# Altium project My_PCB_Board_STM32F407IGT6.PrjPcb
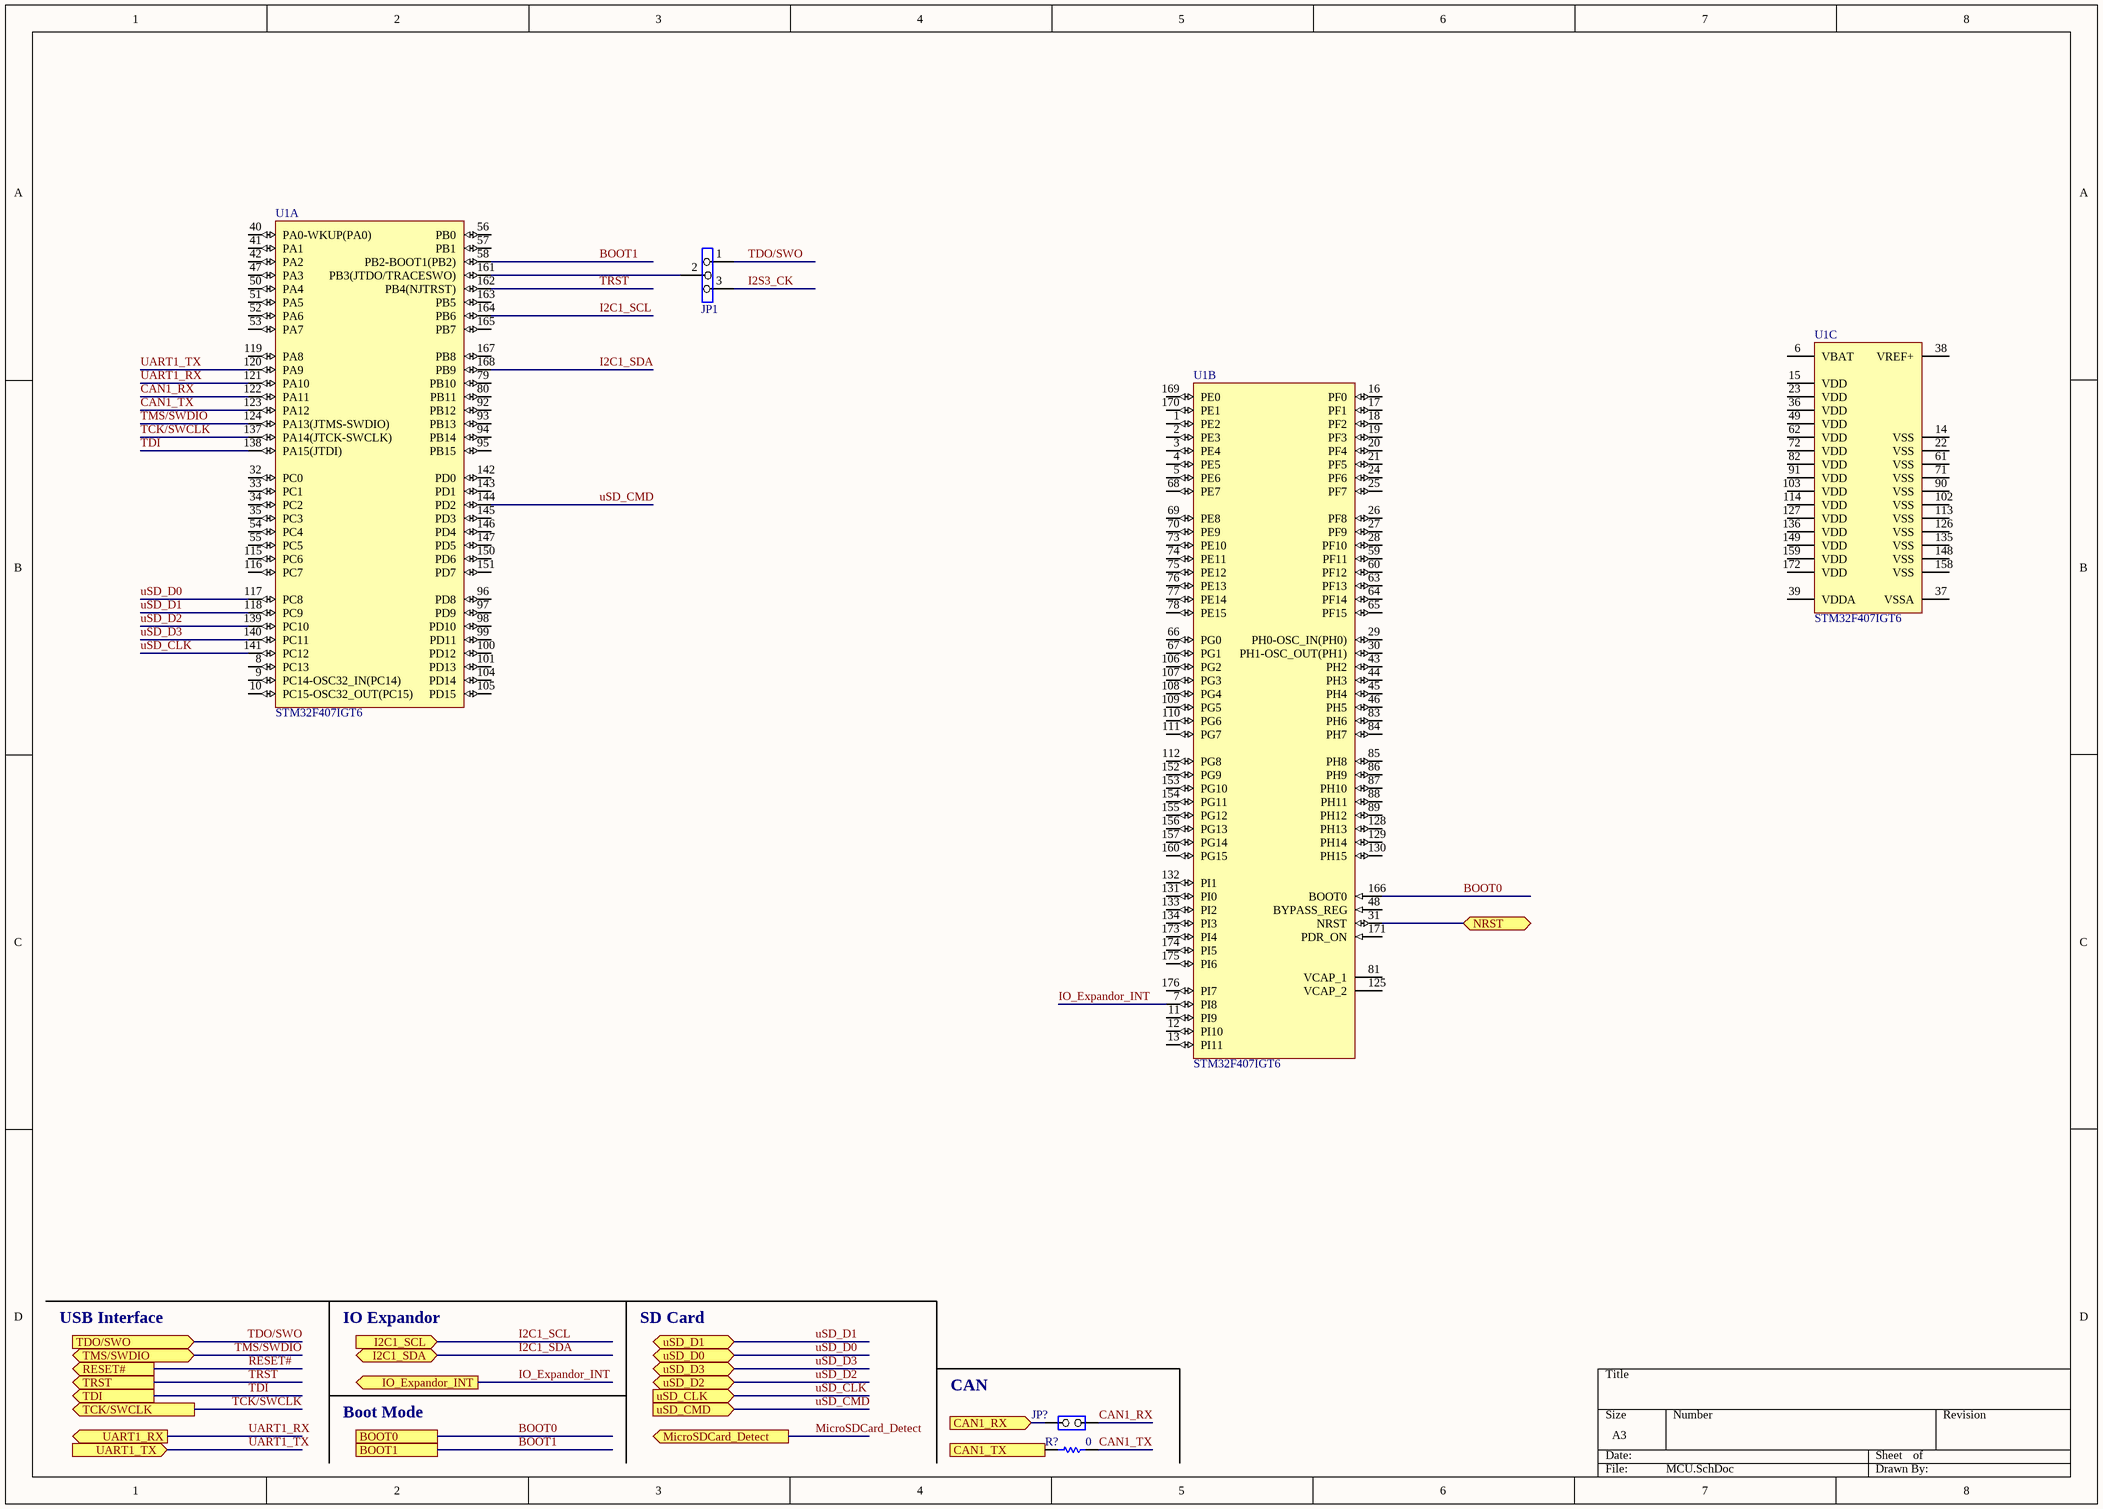
[diagram p0: MCU.SchDoc]
4 sheets, 82 parts. Net scope: flat (ports and power ports of the same name join across sheets).
Board file: PCB1.PcbDoc
Sheets:
  MCU.SchDoc
  Peripherals.SchDoc
  Display-Interface.SchDoc
  Program_Debug-Interface.SchDoc

## Sheet MCU.SchDoc
size A3

### Parts
(Parts that share a designator on the sheet are numbered #1, #2 ... from top to bottom, then left to right.)
JP1  (no value)  [SIP3]
JP?  (no value)  [SIP2]
R?#1  0  [0603R]
U1  STM32F407IGT6  [STM-LQFP176_M]  (parts A,B,C of 3)

### Ports
BOOT0, BOOT1, CAN1_RX (in), CAN1_TX (out), I2C1_SCL (in), I2C1_SDA (bidir), IO_Expandor_INT (out), MicroSDCard_Detect (out), NRST (bidir), RESET# (out), TCK/SWCLK (out), TDI (out), TDO/SWO (in), TMS/SWDIO (bidir), TRST (out), UART1_RX (out), UART1_TX (in), uSD_CLK (in), uSD_CMD (in), uSD_D0 (bidir), uSD_D1 (bidir), uSD_D2 (bidir), uSD_D3 (bidir)

### Nets
BOOT0: U1.166(BOOT0) ; port BOOT0
BOOT1: U1.58(PB2-BOOT1(PB2)) ; port BOOT1
CAN1_RX: JP?.1(COMMON) U1.122(PA11)
CAN1_TX: R?#1.1 U1.123(PA12)
I2C1_SCL: U1.164(PB6) ; port I2C1_SCL
I2C1_SDA: U1.168(PB9) ; port I2C1_SDA
I2S3_CK: JP1.3
IO_Expandor_INT: U1.7(PI8) ; port IO_Expandor_INT
RESET#: U1.31(NRST) ; port NRST
TCK/SWCLK: U1.137(PA14(JTCK-SWCLK)) ; port TCK/SWCLK  [project net T_JTCK]
TDI: U1.138(PA15(JTDI)) ; port TDI  [project net T_JTDI]
TDO/SWO: JP1.1 ; port TDO/SWO  [project net T_JTDO]
TMS/SWDIO: U1.124(PA13(JTMS-SWDIO)) ; port TMS/SWDIO  [project net T_JTMS]
TRST: U1.162(PB4(NJTRST)) ; port TRST  [project net T_JRST]
UART1_RX: U1.121(PA10) ; port UART1_RX
UART1_TX: U1.120(PA9) ; port UART1_TX
uSD_CLK: U1.141(PC12) ; port uSD_CLK
uSD_CMD: U1.144(PD2) ; port uSD_CMD
uSD_D0: U1.117(PC8) ; port uSD_D0
uSD_D1: U1.118(PC9) ; port uSD_D1
uSD_D2: U1.139(PC10) ; port uSD_D2
uSD_D3: U1.140(PC11) ; port uSD_D3
NetJP1_2: JP1.2 U1.161(PB3(JTDO/TRACESWO))
NetJP?_2: JP?.2(NO) ; port CAN1_RX
NetR?#1_2: R?#1.2 ; port CAN1_TX

Not connected (* = marked no-connect by the designer): U1 1(PE2) 2(PE3) 3(PE4) 4(PE5) 5(PE6) 6(VBAT) 8(PC13) 9(PC14-OSC32_IN(PC14)) 10(PC15-OSC32_OUT(PC15)) 11(PI9) 12(PI10) 13(PI11) 14(VSS) 15(VDD) 16(PF0) 17(PF1) 18(PF2) 19(PF3) 20(PF4) 21(PF5) 22(VSS) 23(VDD) 24(PF6) 25(PF7) 26(PF8) 27(PF9) 28(PF10) 29(PH0-OSC_IN(PH0)) 30(PH1-OSC_OUT(PH1)) 32(PC0) 33(PC1) 34(PC2) 35(PC3) 36(VDD) 37(VSSA) 38(VREF+) 39(VDDA) 40(PA0-WKUP(PA0)) 41(PA1) 42(PA2) 43(PH2) 44(PH3) 45(PH4) 46(PH5) 47(PA3) 48(BYPASS_REG) 49(VDD) 50(PA4) 51(PA5) 52(PA6) 53(PA7) 54(PC4) 55(PC5) 56(PB0) 57(PB1) 59(PF11) 60(PF12) 61(VSS) 62(VDD) 63(PF13) 64(PF14) 65(PF15) 66(PG0) 67(PG1) 68(PE7) 69(PE8) 70(PE9) 71(VSS) 72(VDD) 73(PE10) 74(PE11) 75(PE12) 76(PE13) 77(PE14) 78(PE15) 79(PB10) 80(PB11) 81(VCAP_1) 82(VDD) 83(PH6) 84(PH7) 85(PH8) 86(PH9) 87(PH10) 88(PH11) 89(PH12) 90(VSS) 91(VDD) 92(PB12) 93(PB13) 94(PB14) 95(PB15) 96(PD8) 97(PD9) 98(PD10) 99(PD11) 100(PD12) 101(PD13) 102(VSS) 103(VDD) 104(PD14) 105(PD15) 106(PG2) 107(PG3) 108(PG4) 109(PG5) 110(PG6) 111(PG7) 112(PG8) 113(VSS) 114(VDD) 115(PC6) 116(PC7) 119(PA8) 125(VCAP_2) 126(VSS) 127(VDD) 128(PH13) 129(PH14) 130(PH15) 131(PI0) 132(PI1) 133(PI2) 134(PI3) 135(VSS) 136(VDD) 142(PD0) 143(PD1) 145(PD3) 146(PD4) 147(PD5) 148(VSS) 149(VDD) 150(PD6) 151(PD7) 152(PG9) 153(PG10) 154(PG11) 155(PG12) 156(PG13) 157(PG14) 158(VSS) 159(VDD) 160(PG15) 163(PB5) 165(PB7) 167(PB8) 169(PE0) 170(PE1) 171(PDR_ON) 172(VDD) 173(PI4) 174(PI5) 175(PI6) 176(PI7)

### Notes on the sheet
- USB Interface
- IO Expandor
- SD Card
- CAN
- Boot Mode

### Library data of the parts
JP1 = Jumper3
JP? = JP2
R?#1 = Res1: Resistor; Value: 1K; Published: 8-Jun-2000; Revision: July-2002: Re-released for DXP Platform.; Publisher: Altium Limited
U1 = CMP-0243-00010-3: ARM Cortex-M4 32-bit MCU+FPU, 210 DMIPS, 1024 kB Flash, 192 kB Internal RAM, 140 I/Os, 176-pin LQFP, -40 to 85 degC, Tray; Manufacturer: STMicroelectronics; Internal RAM Size (kB): 192; Operating Frequency(F) (Processor speed) (MHz): 168; D/A Converter: 2x12-bit; FLASH Size (Prog) (kB): 1024; Supply Voltage(Vcc) max (V): 3.6; Supply Voltage(Vcc) min (V): 1.8; I/Os (High Current): 140; Packing: Tray; ComponentLink2Description: Datasheet; ComponentLink1Description: Manufacturer URL; DatasheetVersion: Rev. 4; PackageReference: LQFP176; PackageVersion: Rev. 4, 06/2013; ComponentLink1URL: http://www.st.com/web/en/home.html; ComponentLink3URL: http://www.st.com/st-web-ui/static/active/en/resource/technical/document/datasheet/DM00035129.pdf; ComponentLink2URL: http://www.st.com/st-web-ui/static/active/en/resource/technical/document/datasheet/DM00037051.pdf; Mounting Technology: Surface Mount; PartNumber: STM32F407IGT6; Core: ARM Cortex-M4; PackageDescription: 176-Pin Low Profile Quad Flat Package, 24 x 24 mm Body, 0.5 mm Pitch; ComponentLink3Description: Package Specification

## Sheet Peripherals.SchDoc
size A3
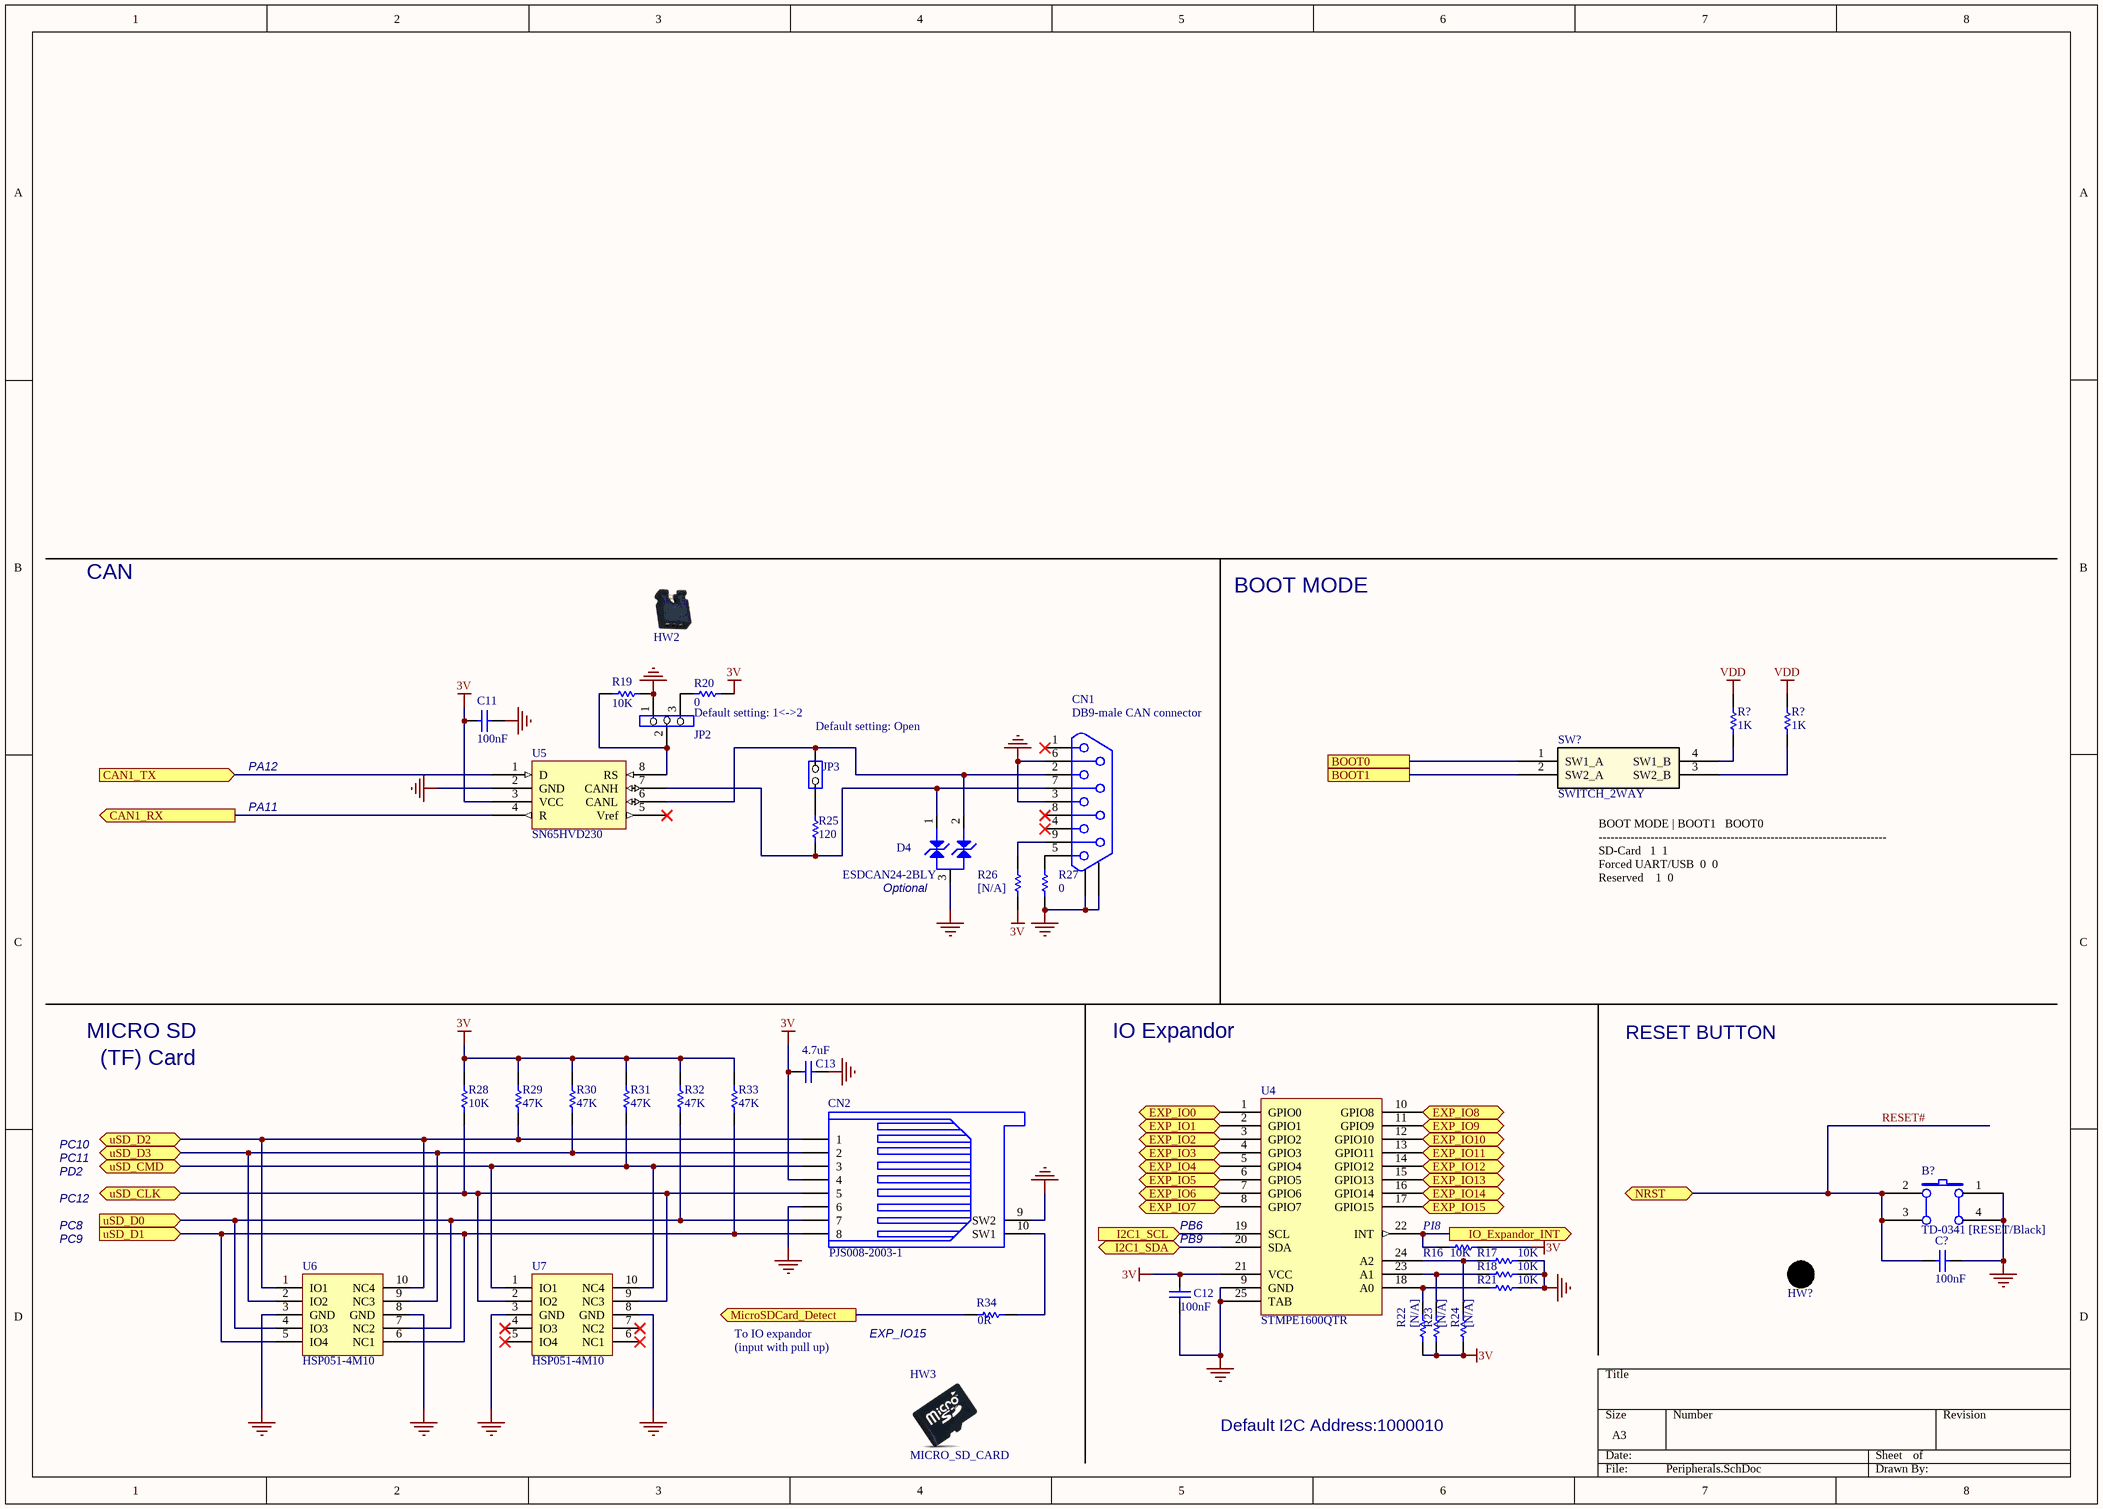
[diagram p1: Peripherals.SchDoc]

### Parts
(Parts that share a designator on the sheet are numbered #1, #2 ... from top to bottom, then left to right.)
B?  TD-0341 [RESET/Black]  [PB10]
C11  100nF  [0603C]
C12  100nF  [0603C]
C13  value 4.7uF  [C0402]  (hidden comment: Capacitor)
C?  100nF  [0603C]
CN1  DB9-male CAN connector  [DB9/M]
CN2  value PJS008-2003-1  [CON_MICROSD_YAMAICHI_PJS008-2003-0]
D4  ESDCAN24-2BLY  [SOT23-213]
HW2  JUMPER_OPEN  (value not drawn)
HW3  Micro_SD_card  (mechanical)
HW?  BUTTON_HAT_BLACK  (value not drawn)  (mechanical)
JP2  (no value)  [SIP3]
JP3  (no value)  [SIP2]
R16  10K  [0603R]
R17  10K  [0603R]
R18  10K  [0603R]
R19  10K  [0603R]
R20  0  [0603R]
R21  10K  [0603R]
R22  [N/A]  [0603R]
R23  [N/A]  [0603R]
R24  [N/A]  [0603R]
R25  120  [0603R]
R26  [N/A]  [0603R]
R27  0  [0603R]
R28  value 10K  [R0402]
R29  value 47K  [R0402]
R30  value 47K  [R0402]
R31  value 47K  [R0402]
R32  value 47K  [R0402]
R33  value 47K  [R0402]
R34  value 0R  [R0402]
R?#2  value 1K  [R0402]
R?#3  value 1K  [R0402]
SW?  SWITCH_2WAY  [SWI_C&K_SDA02H1SBD_2POS]
U4  STMPE1600QTR  [QFN24_0R5_4X4]
U5  SN65HVD230  [SOIC8_1R27_4R9X6]
U6  HSP051-4M10  [ESD_UQFN-10L_2P5X1_P050]
U7  HSP051-4M10  [ESD_UQFN-10L_2P5X1_P050]

### Ports
BOOT0, BOOT1, CAN1_RX (out), CAN1_TX (in), EXP_IO0 (bidir), EXP_IO1 (bidir), EXP_IO2 (bidir), EXP_IO3 (bidir), EXP_IO4 (bidir), EXP_IO5 (bidir), EXP_IO6 (bidir), EXP_IO7 (bidir), EXP_IO8 (bidir), EXP_IO9 (bidir), EXP_IO10 (bidir), EXP_IO11 (bidir), EXP_IO12 (bidir), EXP_IO13 (bidir), EXP_IO14 (bidir), EXP_IO15 (bidir), I2C1_SCL (in), I2C1_SDA (bidir), IO_Expandor_INT (out), MicroSDCard_Detect (out), NRST (bidir), uSD_CLK (bidir), uSD_CMD (bidir), uSD_D0 (in), uSD_D1 (in), uSD_D2 (bidir), uSD_D3 (bidir)

### Nets
3V: C11.1 C12.1 C13.2 CN2.4 R16.1 R20.2 R22.1 R23.1 R24.1 R26.1 R28.2 R29.2 R30.2 R31.2 R32.2 R33.2 U4.21(VCC) U5.3(VCC)
GND: B?.1(A0) B?.4(A1) C11.2 C12.2 C13.1 C?.1 CN1.3 CN1.6 CN1.10 CN1.11 CN2.6 CN2.9(SW2) D4.3 JP2.1 R17.1 R18.1 R19.2 R21.1 R27.1 U4.9(GND) U4.25(TAB) U5.2(GND) U6.3(GND) U6.8(GND) U7.3(GND) U7.8(GND)
VDD: R?#2.2 R?#3.2
BOOT0: SW?.1(SW1_A) ; port BOOT0
BOOT1: SW?.2(SW2_A) ; port BOOT1
I2C1_SCL: U4.19(SCL) ; port I2C1_SCL
I2C1_SDA: U4.20(SDA) ; port I2C1_SDA
IO_Expandor_INT: R16.2 U4.22(INT) ; port IO_Expandor_INT
MicroSDCard_Detect: R34.1 ; port MicroSDCard_Detect
RESET#: B?.2(B0) B?.3(B1) C?.2 ; port NRST
uSD_CLK: CN2.5 R28.1 U7.2(IO2) U7.9(NC3) ; port uSD_CLK
uSD_CMD: CN2.3 R31.1 U7.1(IO1) U7.10(NC4) ; port uSD_CMD
uSD_D0: CN2.7 R32.1 U6.4(IO3) U6.7(NC2) ; port uSD_D0
uSD_D1: CN2.8 R33.1 U6.5(IO4) U6.6(NC1) ; port uSD_D1
uSD_D2: CN2.1 R29.1 U6.1(IO1) U6.10(NC4) ; port uSD_D2
uSD_D3: CN2.2 R30.1 U6.2(IO2) U6.9(NC3) ; port uSD_D3
NetCN1_2: CN1.2 D4.2 JP3.2(NO) U5.6(CANL)
NetCN1_5: CN1.5 R27.2
NetCN1_7: CN1.7 D4.1 R25.1 U5.7(CANH)
NetCN1_9: CN1.9 R26.2
NetCN2_10: CN2.10(SW1) R34.2
NetJP2_2: JP2.2 R19.1 U5.8(RS)
NetJP2_3: JP2.3 R20.1
NetJP3_1: JP3.1(COMMON) R25.2
NetJP?_2: U5.4(R) ; port CAN1_RX
NetR17_2: R17.2 R24.2 U4.24(A2)
NetR18_2: R18.2 R23.2 U4.23(A1)
NetR21_2: R21.2 R22.2 U4.18(A0)
NetR?#1_2: U5.1(D) ; port CAN1_TX
NetR?#2_1: R?#2.1 SW?.4(SW1_B)
NetR?#3_1: R?#3.1 SW?.3(SW2_B)
NetU4_1: U4.1(GPIO0) ; port EXP_IO0
NetU4_2: U4.2(GPIO1) ; port EXP_IO1
NetU4_3: U4.3(GPIO2) ; port EXP_IO2
NetU4_4: U4.4(GPIO3) ; port EXP_IO3
NetU4_5: U4.5(GPIO4) ; port EXP_IO4
NetU4_6: U4.6(GPIO5) ; port EXP_IO5
NetU4_7: U4.7(GPIO6) ; port EXP_IO6
NetU4_8: U4.8(GPIO7) ; port EXP_IO7
NetU4_10: U4.10(GPIO8) ; port EXP_IO8
NetU4_11: U4.11(GPIO9) ; port EXP_IO9
NetU4_12: U4.12(GPIO10) ; port EXP_IO10
NetU4_13: U4.13(GPIO11) ; port EXP_IO11
NetU4_14: U4.14(GPIO12) ; port EXP_IO12
NetU4_15: U4.15(GPIO13) ; port EXP_IO13
NetU4_16: U4.16(GPIO14) ; port EXP_IO14
NetU4_17: U4.17(GPIO15) ; port EXP_IO15

Not connected (* = marked no-connect by the designer): CN1 1* 4* 8*; U5 5(Vref)*; U7 4(IO3)* 5(IO4)* 6(NC1)* 7(NC2)*

### Notes on the sheet
- CAN
- BOOT MODE
- Default setting: 1<->2
- PA12
- (near JP3) Default setting: Open
- PA11
- (near D4) Optional
- (near SW?) BOOT MODE	|	BOOT1 		BOOT0
  ------------------------------------------------------------------------
  SD-Card			1		1
  Forced UART/USB		0		0
  Reserved 			1		0
- MICRO SD
- IO Expandor
- RESET BUTTON
- (TF) Card
- PC10
- PC11
- PD2
- PC8
- PC9
- PC12
- PB9
- PB6
- (near R16) PI8
- (input with pull up)
- To IO expandor
- EXP_IO15
- Default I2C Address:1000010

### Library data of the parts
B? = SW PUSHBUTTON: SE PUSHBUTTON
C11 C12 = Cap: Capacitor; Value: 10nF; Published: 8-Jun-2000; Revision: July-2002: Re-released for DXP Platform.; Publisher: Altium Limited
C13 = MCD-01356: Capacitor, MLCC, 4.7uF, 6V3, X5R, 20%, 0402, T=0,5mm; Manufacturer_Part_Number: GRM155R60J475ME47; Manufacturer: MURATA; Provided_By: SUBCO; Internal_Part_Number: MCD-01356; Status: Released; Part_Type: Capacitor; Package: C0402; ComponentLink1Description: Datasheet; ComponentLink1URL: http://tunmcdsvn.tun.st.com/Component_Datasheet_Library/Trunk/Capacitors/Murata_Capacitor_GR_series
C? = CAP: Capacitor; Value: 100pF; Published: 8-Jun-2000; Revision: July-2002: Re-released for DXP Platform.; Publisher: Altium Limited
CN1 = DB9-CAN
CN2 = MCD-00023: MicroSD Card Conn, Reversed-Type, Mnt Push-Push; Manufacturer: YAMAICHI; Part_Type: Connector; Provided_By: SUBCO; Initial_Board_Reference: mb1274; Internal_Part_Number: MCD-00023; Manufacturer_Part_Number: PJS008-2003-1; ComponentLink1Description: Datasheet; ECCN_US: n/a; ECCN_EU: n/a; Status: Released; ComponentLink1URL: http://tunmcdsvn.tun.st.com/Component_Datasheet_Library/Trunk/Connectors/Yamaichi_Connector_microSD-Card-PJS008-2003
HW3 = MCD-01200: MICRO_SD_CARD Standard min 4GB; Part_Type: Misc; Manufacturer: NETAC; Alternate_Manufacturer: Jiubaba; Alternate_Manufacturer_Part_Number: 988.05.20.3.00018; Provided_By: SUBCO; Initial_Board_Reference: MB1372; Internal_Part_Number: MCD-01200; Value: MICRO_SD_CARD; Status: Checked; Manufacturer_Part_Number: SD_CARD; ComponentLink1Description: Datasheet; ComponentLink1URL: http://na; ECCN_US: n/a; ECCN_EU: n/a
JP2 = Jumper3
JP3 = JP2
R16 R19 R22-R24 = Res1: Resistor; Value: 1K; Published: 8-Jun-2000; Revision: July-2002: Re-released for DXP Platform.; Publisher: Altium Limited
R17 R18 R20 R21 R25-R27 = res1: Resistor; Value: 1K; Published: 8-Jun-2000; Revision: July-2002: Re-released for DXP Platform.; Publisher: Altium Limited
R28 = MCD-00053: Resistor,10K,0402,1%,1/16W; Manufacturer_Part_Number: RC0402FR-0710KL; Manufacturer: YAGEO; Provided_By: SUBCO; Initial_Board_Reference: mb1274; Internal_Part_Number: MCD-00053; ComponentLink1Description: Datasheet; ECCN_US: n/a; ECCN_EU: n/a; Status: Released; Part_Type: Resistor; ComponentLink1URL: http://tunmcdsvn.tun.st.com/Component_Datasheet_Library/Trunk/Resistors/Yageo_Resistor_RC0402-series; Package: R0402
R29-R33 = MCD-00063: Resistor,47K,0402,1%,1/16W; Manufacturer_Part_Number: RC0402FR-0747KL; Manufacturer: YAGEO; Provided_By: SUBCO; Initial_Board_Reference: mb1274; Internal_Part_Number: MCD-00063; ComponentLink1Description: Datasheet; ECCN_US: n/a; ECCN_EU: n/a; Status: Released; Part_Type: Resistor; ComponentLink1URL: http://tunmcdsvn.tun.st.com/Component_Datasheet_Library/Trunk/Resistors/Yageo_Resistor_RC0402-series; Package: R0402
R34 = MCD-00052: Resistor,0R,0402,5%,1/16W; Manufacturer_Part_Number: RC0402JR-070RL; Manufacturer: YAGEO; Provided_By: SUBCO; Initial_Board_Reference: mb1274; Internal_Part_Number: MCD-00052; ComponentLink1Description: Datasheet; ECCN_US: n/a; ECCN_EU: n/a; Status: Released; Part_Type: Resistor; ComponentLink1URL: http://tunmcdsvn.tun.st.com/Component_Datasheet_Library/Trunk/Resistors/Yageo_Resistor_RC0402-series; Package: R0402
R?#2 R?#3 = MCD-00061: Resistor,1K,0402,1%,1/16W; Manufacturer_Part_Number: RC0402FR-071KL; Manufacturer: YAGEO; Provided_By: SUBCO; Initial_Board_Reference: mb1274; Internal_Part_Number: MCD-00061; ComponentLink1Description: Datasheet; ECCN_US: n/a; ECCN_EU: n/a; Status: Released; Part_Type: Resistor; ComponentLink1URL: http://tunmcdsvn.tun.st.com/Component_Datasheet_Library/Trunk/Resistors/Yageo_Resistor_RC0402-series; Package: R0402
SW? = MCD-00658: Dip Switch ,2Position ,Surface Mount Slide (Standard) ,2.54 pitch,25mA 24VDC; Part_Type: Misc; Manufacturer_Part_Number: SDA02H1SBD; Manufacturer: C&K; Provided_By: SUBCO; Initial_Board_Reference: MB1272; Internal_Part_Number: MCD-00658; Value: SWITCH_2WAY; Status: Footprint available; Package: DIP; ComponentLink1Description: Datasheet; ComponentLink1URL: http://tunmcdsvn.tun.st.com/Component_Datasheet_Library/Trunk/Misc/CK_switch_dip_sda_series; ECCN_US: n/a; ECCN_EU: n/a
U4 = STMPE1600
U5 = SN65HVD230D
U6 U7 = MCD-00667: 4-line ESD protection for high speed lines; Part_Type: Diode; Manufacturer: STMICROELECTRONICS; BMS_Part_Number: 9179041; ECCN_US: EAR99; ECCN_EU: NEC; Provided_By: SUBCO with ST control; Initial_Board_Reference: MB1331; Internal_Part_Number: MCD-00667; Value: HSP051-4M10; Status: Checked; Manufacturer_Part_Number: HSP051-4M10; Package: uQFN-10L; ComponentLink1Description: Datasheet; ComponentLink1URL: http://tunmcdsvn.tun.st.com/Component_Datasheet_Library/Trunk/Diodes/STM_ESD_HSP051-4M10

## Sheet Display-Interface.SchDoc
size A3
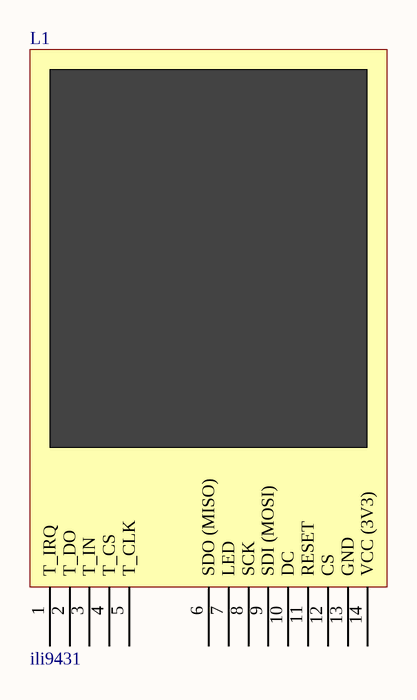
[diagram p2: Display-Interface.SchDoc]

### Parts
L1  ili9431  [ILI9431]

### Nets

Not connected (* = marked no-connect by the designer): L1 1(T_IRQ) 2(T_DO) 3(T_IN) 4(T_CS) 5(T_CLK) 6(SDO_(MISO)) 7(LED) 8(SCK) 9(SDI_(MOSI)) 10(DC) 11(RESET) 12(CS) 13(GND) 14(VCC_(3V3))

## Sheet Program_Debug-Interface.SchDoc
size A3
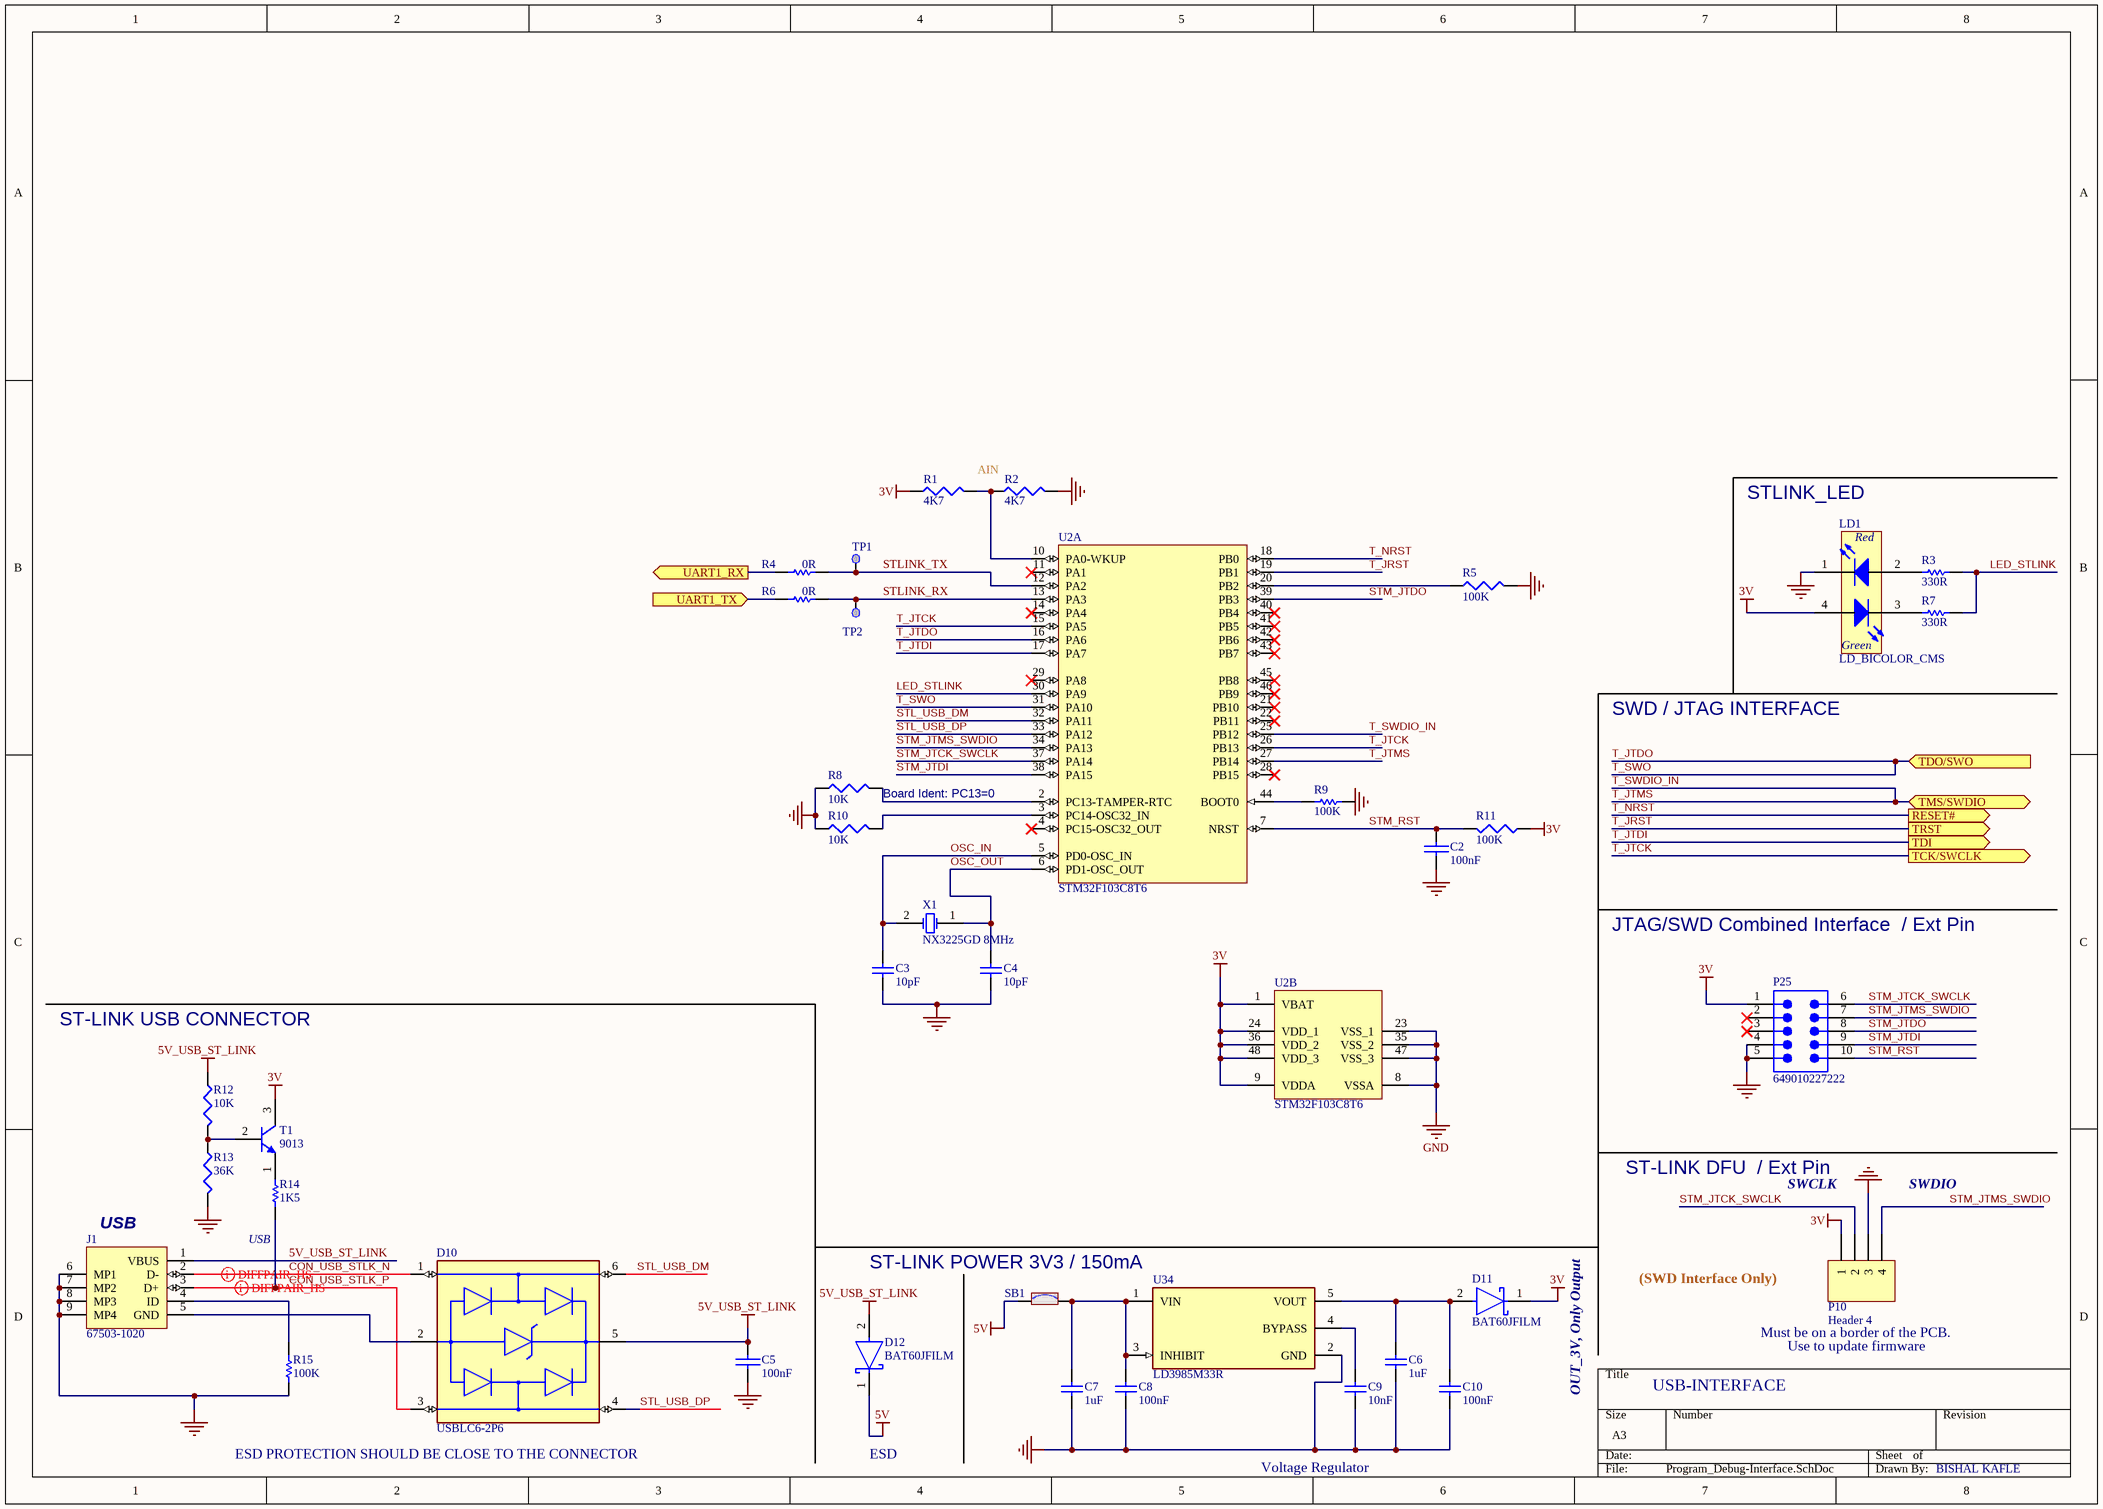
[diagram p3: Program_Debug-Interface.SchDoc]

### Parts
C2  100nF  [0603C]
C3  value 10pF  [C0402]
C4  value 10pF  [C0402]
C5  100nF  [0603C]
C6  value 1uF  [C0603]
C7  value 1uF  [C0603]
C8  value 100nF  [C0402]
C9  value 10nF  [C0402]
C10  value 100nF  [C0402]
D10  USBLC6-2P6  [FP-SOT-666-MFG]
D11  BAT60JFILM  [FP-BAT60JFILM-MFG]
D12  BAT60JFILM  [FP-BAT60JFILM-MFG]
J1  67503-1020  [MOLX-67503-1020_V]
LD1  value LD_BICOLOR_CMS  [LED_BI-GR_HSMF-A201-A00J1]
P10  Header 4  [HDR1X4]
P25  649010227222  [649010227222]
R1  4K7  [0603R]
R2  4K7  [0603R]
R3  value 330R  [R0402]
R4  value 0R  [R0402]
R5  100K  [0603R]
R6  value 0R  [R0402]
R7  value 330R  [R0402]
R8  10K  [0603R]
R9  value 100K  [R0402]
R10  10K  [0603R]
R11  100K  [0603R]
R12  10K  [0603R]
R13  36K  [0603R]
R14  1K5  [0603R]
R15  value 100K  [R0402]
SB1  (no value)  [SOLDER-BRIDGE_R0603-0R]
T1  9013  [SOT23-213]
TP1  Test Point  [TP_SMD_1MM]  (value not drawn)  (no BOM)
TP2  Test Point  [TP_SMD_1MM]  (value not drawn)  (no BOM)
U2  STM32F103C8T6  [STM-LQFP48_L]  (parts A,B of 2)
U34  LD3985M33R  [FP-SOT23-5L-7049676-MFG]
X1  value NX3225GD 8MHz  [CRY_NX3225GD_2P]

### Ports
RESET# (out), TCK/SWCLK (out), TDI (out), TDO/SWO (in), TMS/SWDIO (bidir), TRST (out), UART1_RX (out), UART1_TX (in)

### Nets
3V: D11.1(K) LD1.4(YellowGreen_anode) P10.1 P25.1 R1.1 R11.2 T1.3(C) U2.1(VBAT) U2.9(VDDA) U2.24(VDD_1) U2.36(VDD_2) U2.48(VDD_3)
5V: D12.1(K) SB1.1
5V_USB_ST_LINK: C5.1 D10.5(VBUS) D12.2(A) J1.1(VBUS) R12.1
GND: C2.1 C3.2 C4.2 C5.2 C6.1 C7.2 C8.1 C9.1 C10.1 J1.6(MP1) J1.7(MP2) J1.8(MP3) J1.9(MP4) LD1.1(RED_cathode) P10.3 P25.4 P25.5 R2.2 R5.2 R8.1 R10.1 R13.2 R15.1 U2.8(VSSA) U2.23(VSS_1) U2.35(VSS_2) U2.47(VSS_3) U34.2(GND)
CON_USB_STLK_N: D10.1(I/O1) J1.2(D-)
CON_USB_STLK_P: D10.3(I/O2) J1.3(D+) R14.2
LED_STLINK: R3.2 R7.2 U2.30(PA9)
OSC_IN: C3.1 U2.5(PD0-OSC_IN) X1.2(OSC2)
OSC_OUT: C4.1 U2.6(PD1-OSC_OUT) X1.1(OSC1)
STL_USB_DM: D10.6(I/O1) U2.32(PA11)
STL_USB_DP: D10.4(I/O2) U2.33(PA12)
STLINK_RX: R6.2 TP2.1 U2.13(PA3)
STLINK_TX: R4.1 TP1.1 U2.12(PA2)
STM_JTCK_SWCLK: P10.2 P25.6 U2.37(PA14)
STM_JTDI: P25.9 U2.38(PA15)
STM_JTDO: P25.8 U2.39(PB3)
STM_JTMS_SWDIO: P10.4 P25.7 U2.34(PA13)
STM_RST: C2.2 P25.10 R11.1 U2.7(NRST)
T_JRST: U2.19(PB1) ; port TRST
T_JTCK: U2.15(PA5) U2.26(PB13) ; port TCK/SWCLK
T_JTDI: U2.17(PA7) ; port TDI
T_JTDO: U2.16(PA6) U2.31(PA10) ; port TDO/SWO  [also labelled T_SWO]
T_JTMS: U2.25(PB12) U2.27(PB14) ; port TMS/SWDIO  [also labelled T_SWDIO_IN]
T_NRST: U2.18(PB0) ; port RESET#  [project net RESET#]
UART1_RX: R4.2 ; port UART1_RX
UART1_TX: R6.1 ; port UART1_TX
NetC6_2: C6.2 C10.2 D11.2(A) U34.5(VOUT)
NetC7_1: C7.1 C8.2 SB1.2 U34.1(VIN) U34.3(INHIBIT)
NetC9_2: C9.2 U34.4(BYPASS)
NetD10_2: D10.2(GND) J1.5(GND)
NetJ1_4: J1.4(ID) R15.2
NetLD1_2: LD1.2(Red_anode) R3.1
NetLD1_3: LD1.3(YellowGreen_cathode) R7.1
NetR1_2: R1.2 R2.1 U2.10(PA0-WKUP)
NetR5_1: R5.1 U2.20(PB2)
NetR8_2: R8.2 U2.2(PC13-TAMPER-RTC)
NetR9_2: R9.2 U2.44(BOOT0)
NetR10_2: R10.2 U2.3(PC14-OSC32_IN)
NetR12_2: R12.2 R13.1 T1.2(B)

Not connected (* = marked no-connect by the designer): P25 2* 3*; R9 1; R14 1; T1 1(E); U2 4(PC15-OSC32_OUT)* 11(PA1)* 14(PA4)* 21(PB10)* 22(PB11)* 28(PB15)* 29(PA8)* 40(PB4)* 41(PB5)* 42(PB6)* 43(PB7)* 45(PB8)* 46(PB9)*

### Layout directives
differential pair: CON_USB_STLK_N, CON_USB_STLK_P

### Notes on the sheet
- AIN
- STLINK_LED
- SWD / JTAG INTERFACE
- (near R8) Board Ident: PC13=0
- JTAG/SWD Combined Interface  / Ext Pin
- ST-LINK USB CONNECTOR
- ST-LINK DFU  / Ext Pin
- SWCLK
- SWDIO
- (near J1) USB
- (near R14) USB
- (near SB1) ST-LINK POWER 3V3 / 150mA
- (SWD Interface Only)
- OUT_3V, Only Output
- USB-INTERFACE
- Must be on a border of the PCB.
- Use to update firmware
- (near D10) ESD PROTECTION SHOULD BE CLOSE TO THE CONNECTOR
- ESD
- Voltage Regulator
- BISHAL KAFLE
- Labels drawn without touching a wire or pin: GND
- (in symbol MCD-00051) Red; Green

### Library data of the parts
C2 = CAP
C3 C4 = MCD-00015: Capacitor,10pF,50V,NPO,5%,0402; Manufacturer_Part_Number: CC0402JRNPO9BN100; Manufacturer: YAGEO; Provided_By: SUBCO; Initial_Board_Reference: mb1274; Internal_Part_Number: MCD-00015; ComponentLink1Description: Datasheet; ECCN_US: n/a; ECCN_EU: n/a; Status: Released; Part_Type: Capacitor; Package: C0402; ComponentLink1URL: http://tunmcdsvn.tun.st.com/Component_Datasheet_Library/Trunk/Capacitors/Yageo_Capacitor_NP0_16V-to-50V
C5 = CAP: Capacitor
C6 C7 = MCD-00238: Capacitor,1uF,6V3,X5R,10%,0603; Manufacturer_Part_Number: CC0603KRX5R5BB105; Manufacturer: YAGEO; Provided_By: SUBCO; Initial_Board_Reference: mb1319; Internal_Part_Number: MCD-00238; ComponentLink1Description: Datasheet; ECCN_US: n/a; ECCN_EU: n/a; Status: Released; Part_Type: Capacitor; Package: C0603; ComponentLink1URL: http://tunmcdsvn.tun.st.com/Component_Datasheet_Library/Trunk/Capacitors/Yageo_Multilayer_capacitor_X5R_series_100pF_to_100uF
C8 C10 = MCD-00006: Capacitor,100nF,16V,X7R,10%,0402; Manufacturer_Part_Number: CC0402KRX7R7BB104; Manufacturer: YAGEO; Alternate_Manufacturer: MURATA; Alternate_Manufacturer_Part_Number: GCM155R71C104KA55D; Provided_By: SUBCO; Initial_Board_Reference: mb1274; Internal_Part_Number: MCD-00006; ComponentLink1Description: Datasheet; ECCN_US: n/a; ECCN_EU: n/a; Status: Released; Part_Type: Capacitor; Package: C0402; ComponentLink1URL: http://tunmcdsvn.tun.st.com/Component_Datasheet_Library/Trunk/Capacitors/Yageo_Multilayer_Capacitor_X7R_series_100pF_to_22uF
C9 = MCD-00011: Capacitor,10nF,16V,X7R,10%,0402; Manufacturer_Part_Number: CC0402KRX7R7BB103; Manufacturer: YAGEO; Provided_By: SUBCO; Initial_Board_Reference: mb1274; Internal_Part_Number: MCD-00011; ComponentLink1Description: Datasheet; ECCN_US: n/a; ECCN_EU: n/a; Status: Released; Part_Type: Capacitor; Package: C0402; ComponentLink1URL: http://tunmcdsvn.tun.st.com/Component_Datasheet_Library/Trunk/Capacitors/Yageo_Multilayer_Capacitor_X7R_series_100pF_to_22uF
D10 = CMP-12225-000058-1: TVS DIODE 5.25V 17V SOT666; Min Breakdown Voltage: 6V; Power Line Protection: Yes; Element Configuration: Dual; Test Current: 1mA; Working Voltage: 5V; Number of Channels: 2; Max Reverse Leakage Current: 150nA; Direction: Unidirectional; Peak Pulse Current: 5A; Number of Elements: 1; Capacitance: 3.5pF; Max Breakdown Voltage: 6V; Height: 0.6mm; Depth: 1.3mm; Contact Plating: Tin; Reverse Breakdown Voltage: 6V; REACH SVHC: No SVHC; Operating Supply Voltage: 5V; Width: 1.3mm; Max Operating Temperature: 125°C; Reverse Standoff Voltage: 5V; ESD Protection: Yes; Package Quantity: 1; Termination: SMD/SMT; Length: 1.7mm; Leakage Current: 150nA; Number of Bidirectional Channels: 2; Case/Package: SOT-666; Min Operating Temperature: -40°C; Number of Pins: 6; Clamping Voltage: 17V; Breakdown Voltage: 6V; Lead Free: Lead Free; Radiation Hardening: No; Packaging: Tape and Reel; Mount: Surface Mount; Polarity: Unidirectional
D11 D12 = CMP-12187-000028-1: DIODE SCHOTTKY 10V 3A SOD323; Max Forward Surge Current (Ifsm): 5A; Forward Voltage: 580mV; Max Reverse Leakage Current: 7.5uA; Element Configuration: Single; Polarity: Standard; Output Current: 3A; Contact Plating: Tin; Package Quantity: 1; Mount: Surface Mount; Min Operating Temperature: -65°C; Average Rectified Current: 3A; Packaging: Tape and Reel; Forward Current: 3A; Height: 1.07mm; Length: 1.8mm; REACH SVHC: No SVHC; Peak Non-Repetitive Surge Current: 5A; Max Surge Current: 5A; Width: 1.45mm; Current Rating: 3A; Lead Free: Lead Free; Radiation Hardening: No; Max Reverse Voltage (DC): 10V; Peak Reverse Current: 7.5uA; Voltage Rating (DC): 10V; Max Operating Temperature: 150°C; Max Repetitive Reverse Voltage (Vrrm): 10V; Number of Pins: 2; Weight: 0.01lb
J1 = MOLX-67503-1020: USB, MINI, SMD, RA KME04-USBMU03A01; Manufacturer: Molex; ComponentLink1URL: http://www.molex.com/; PartNumber: 67503-1020; Mounting Technology: Surface Mount; ComponentLink1Description: Manufacturer URL; Terminal Pitch: 0.8 mm; DatasheetVersion: Rev F, 06/2009; ComponentLink2Description: Datasheet; PackageDescription: Mini USB Connector, SMT, Righer Angle; ComponentLink2URL: http://www.molex.com/pdm_docs/sd/675031020_sd.pdf; PackageReference: 67503-1020
LD1 = MCD-00051: LED Bicolor; Manufacturer_Part_Number: HSMF-A201-A00J1; Manufacturer: AVAGO TECHNOLOGIES; Alternate_Manufacturer_Part_Number: LE-RGW35280; Alternate_Manufacturer: EVERLUCK; Part_Type: Display; ECCN_US: EAR99; ECCN_EU: NEC; Provided_By: SUBCO; Initial_Board_Reference: mb1274; Internal_Part_Number: MCD-00051; ComponentLink1Description: Datasheet; Status: Released; ComponentLink1URL: http://tunmcdsvn.tun.st.com/Component_Datasheet_Library/Trunk/Display/Avago_LED-SMC_HSMx-A2xx-02Feb2012
P10 = Header 4: Header, 4-Pin Male; MPN: PEC04SFAN; PN: S1212E-04-ND; URL: http://www.digikey.ca/product-detail/en/PEC04SFAN/S1212E-04-ND
P25 = CMP-1502-00532-2: NexarPartId: 8917592; Number of Positions: 10; Operating Supply Voltage: 600V; Pitch: 4.2mm; Gender: Male; Row Spacing: 5.5118mm; Contact Resistance: 10mΩ; Connector Type: Male Pin, Socket; Insulation: Insulated; Insulation Resistance: 1GΩ; Current Rating: 7A; Contact Plating: Tin; Fastening Type: Ramp; Lead Pitch: 4.2mm; Number of Pins: 10; Contact Gender: Male; Termination: Through Hole; Length: 22.2mm; Max Operating Temperature: 105°C; Housing Material: Nylon; Contact Material: Copper; Voltage Rating: 600V; REACH SVHC: Unknown; Flammability Rating: UL94 V-0; RoHS: Compliant; Height: 12.8mm; Width: 22.3mm; Color: White; Mount: Through Hole; Min Operating Temperature: -40°C; Number of Rows: 2; Number of Contacts: 10
R1 R2 R5 R11 = RES1
R3 R7 = MCD-00062: Resistor,330R,0402,1%,1/16W; Manufacturer_Part_Number: RC0402FR-07330RL; Manufacturer: YAGEO; Provided_By: SUBCO; Initial_Board_Reference: mb1274; Internal_Part_Number: MCD-00062; ComponentLink1Description: Datasheet; ECCN_US: n/a; ECCN_EU: n/a; Status: Released; Part_Type: Resistor; ComponentLink1URL: http://tunmcdsvn.tun.st.com/Component_Datasheet_Library/Trunk/Resistors/Yageo_Resistor_RC0402-series; Package: R0402
R4 R6 = MCD-00052: as R34 on sheet Peripherals; Internal_Part_Number: MCD-00052; ComponentLink1Description: Datasheet; ECCN_US: n/a; ECCN_EU: n/a; Status: Released; Part_Type: Resistor; ComponentLink1URL: http://tunmcdsvn.tun.st.com/Component_Datasheet_Library/Trunk/Resistors/Yageo_Resistor_RC0402-series; Package: R0402
R8 R10 R12 R13 = R: Right: 20; Bottom: 30
R9 R15 = MCD-00059: Resistor,100K,0402,1%,1/16W; Manufacturer_Part_Number: RC0402FR-07100KL; Manufacturer: YAGEO; Alternate_Manufacturer_Part_Number: RT0402FRE07100KL; Provided_By: SUBCO; Initial_Board_Reference: mb1274; Internal_Part_Number: MCD-00059; Alternate_Manufacturer: YAGEO; ComponentLink1Description: Datasheet; ECCN_US: n/a; ECCN_EU: n/a; Status: Released; Part_Type: Resistor; ComponentLink1URL: http://tunmcdsvn.tun.st.com/Component_Datasheet_Library/Trunk/Resistors/Yageo_Resistor_RC0402-series; Package: R0402
R14 = Res1: Resistor; Value: 1K; Published: 8-Jun-2000; Revision: July-2002: Re-released for DXP Platform.; Publisher: Altium Limited
SB1 = MCD-00071: Solder Bridge ON; Part_Type: Mechanical; Manufacturer: YAGEO; Manufacturer_Part_Number: RC0603JR-070RL; Provided_By: SUBCO; Initial_Board_Reference: mb1274; Internal_Part_Number: MCD-00071; ECCN_US: n/a; ECCN_EU: n/a; Status: Released; ComponentLink1Description: Datasheet; ComponentLink1URL: http://tunmcdsvn.tun.st.com/Component_Datasheet_Library/Trunk/Resistors/Yageo_Resistor_RC0603-series; Package: SB0603
T1 = NPN: NPN Bipolar Transistor; Code - JEDEC: TO-226-AA; Published: 8-Jun-2000; Revision: July-2002: Re-released for DXP Platform.; Publisher: Altium Limited
TP1 TP2 = MCD-00074: Test Point 1mm; Part_Type: Mechanical; Initial_Board_Reference: MB1274; Internal_Part_Number: MCD-00074; Status: Released; Manufacturer_Part_Number: n/a; Manufacturer: n/a; ComponentLink1Description: Datasheet; ComponentLink1URL: http://na; ECCN_US: n/a; ECCN_EU: n/a; Provided_By: n/a
U2 = CMP-0237-00215-3: ARM Cortex-M3 32-bit MCU, 64 KB Flash, 20 KB Internal RAM, 37 I/Os, 48-pin LQFP, -40 to 85 degC, Tray; Supply Voltage(Vcc) min (V): 2; Internal RAM Size (kB): 20; FLASH Size (Prog) (kB): 64; A/D Converter: 2x12-bit (10 Channel); I/Os (High Current): 37; Operating Frequency(F) (Processor speed) (MHz): 72; Core: ARM Cortex-M3; ComponentLink3Description: Package Specification; Mounting Technology: Surface Mount; PartNumber: STM32F103C8T6; PackageReference: LQFP48; Packing: Tray; ComponentLink3URL: http://www.st.com/st-web-ui/static/active/en/resource/technical/document/datasheet/DM00058181.pdf; DatasheetVersion: Rev. 16; ComponentLink1URL: http://www.st.com/web/en/home.html; PackageVersion: Rev. 6, 06/2013; ComponentLink2URL: http://www.st.com/st-web-ui/static/active/en/resource/technical/document/datasheet/CD00161566.pdf; ComponentLink1Description: Manufacturer URL; ComponentLink2Description: Datasheet; PackageDescription: 48-Pin Low Profile Quad Flat Package, 7 x 7 mm Body, 0.5 mm Pitch
U34 = CMP-0244-00328-3: NexarPartId: 526998; Min Output Voltage: 3.3V; Min Input Voltage: 2.5V; Max Junction Temperature (Tj): 125°C; Min Current Limit: 300mA; Input Bias Current: 85µA; Max Supply Voltage: 6V; Quiescent Current: 150µA; Max Output Current: 150mA; Number of Channels: 1; Output Type: Fixed; Output Voltage Accuracy: 2%; Polarity: Positive; Dropout Voltage: 60mV; Width: 1.75mm; Height: 1.3mm; Lifecycle Status: Production; Case/Package: SOT-23; RoHS: Compliant; Output Current: 150mA; Radiation Hardening: No; Number of Regulators: 1; Max Operating Temperature: 125°C; Output Voltage: 3.3V; Min Supply Voltage: 2.5V; Min Operating Temperature: -40°C; Accuracy: 2%; Number of Outputs: 1; Number of Pins: 5; Packaging: Cut Tape (CT); Lead Free: Lead Free; Schedule B: 8542390000, 8542390000; Mount: Surface Mount; Max Input Voltage: 6V; Length: 3mm
X1 = MCD-00092: Crystal 8Mhz, 8pF, -+50PPM, SMD; Manufacturer_Part_Number: NX3225GD 8MHz EXS00A-CG04874; Manufacturer: NDK; Part_Type: Crystal_Osc; BMS_Part_Number: 9157029; ECCN_US: EAR99; ECCN_EU: NEC; Provided_By: SUBCO; Initial_Board_Reference: mb1274; Internal_Part_Number: MCD-00092; ComponentLink1Description: Datasheet; Status: Released; ComponentLink1URL: http://tunmcdsvn.tun.st.com/Component_Datasheet_Library/Trunk/Crystal_Osc/NDK_Crystal-For-ST_NX3225GD 8MHz EXS00A-CG04874 (EXS10B-20725)

## Nets that join several sheets
3V: Peripherals (18 pins), Program_Debug-Interface (12 pins)
GND: Peripherals (26 pins), Program_Debug-Interface (28 pins)
BOOT0: MCU (U1.166), Peripherals (SW?.1)
BOOT1: MCU (U1.58), Peripherals (SW?.2)
I2C1_SCL: MCU (U1.164), Peripherals (U4.19)
I2C1_SDA: MCU (U1.168), Peripherals (U4.20)
IO_Expandor_INT: MCU (U1.7), Peripherals (R16.2 U4.22)
NetJP?_2: MCU (JP?.2), Peripherals (U5.4)
NetR?#1_2: MCU (R?#1.2), Peripherals (U5.1)
RESET#: MCU (U1.31), Peripherals (B?.2 B?.3 C?.2)
T_JRST: MCU (U1.162), Program_Debug-Interface (U2.19)
T_JTCK: MCU (U1.137), Program_Debug-Interface (U2.15 U2.26)
T_JTDI: MCU (U1.138), Program_Debug-Interface (U2.17)
T_JTDO: MCU (JP1.1), Program_Debug-Interface (U2.16 U2.31)
T_JTMS: MCU (U1.124), Program_Debug-Interface (U2.25 U2.27)
UART1_RX: MCU (U1.121), Program_Debug-Interface (R4.2)
UART1_TX: MCU (U1.120), Program_Debug-Interface (R6.1)
uSD_CLK: MCU (U1.141), Peripherals (CN2.5 R28.1 U7.2 U7.9)
uSD_CMD: MCU (U1.144), Peripherals (CN2.3 R31.1 U7.1 U7.10)
uSD_D0: MCU (U1.117), Peripherals (CN2.7 R32.1 U6.4 U6.7)
uSD_D1: MCU (U1.118), Peripherals (CN2.8 R33.1 U6.5 U6.6)
uSD_D2: MCU (U1.139), Peripherals (CN2.1 R29.1 U6.1 U6.10)
uSD_D3: MCU (U1.140), Peripherals (CN2.2 R30.1 U6.2 U6.9)